# Altium schematic sheet LM2576_DC-DC_Converter.SchDoc
size A0
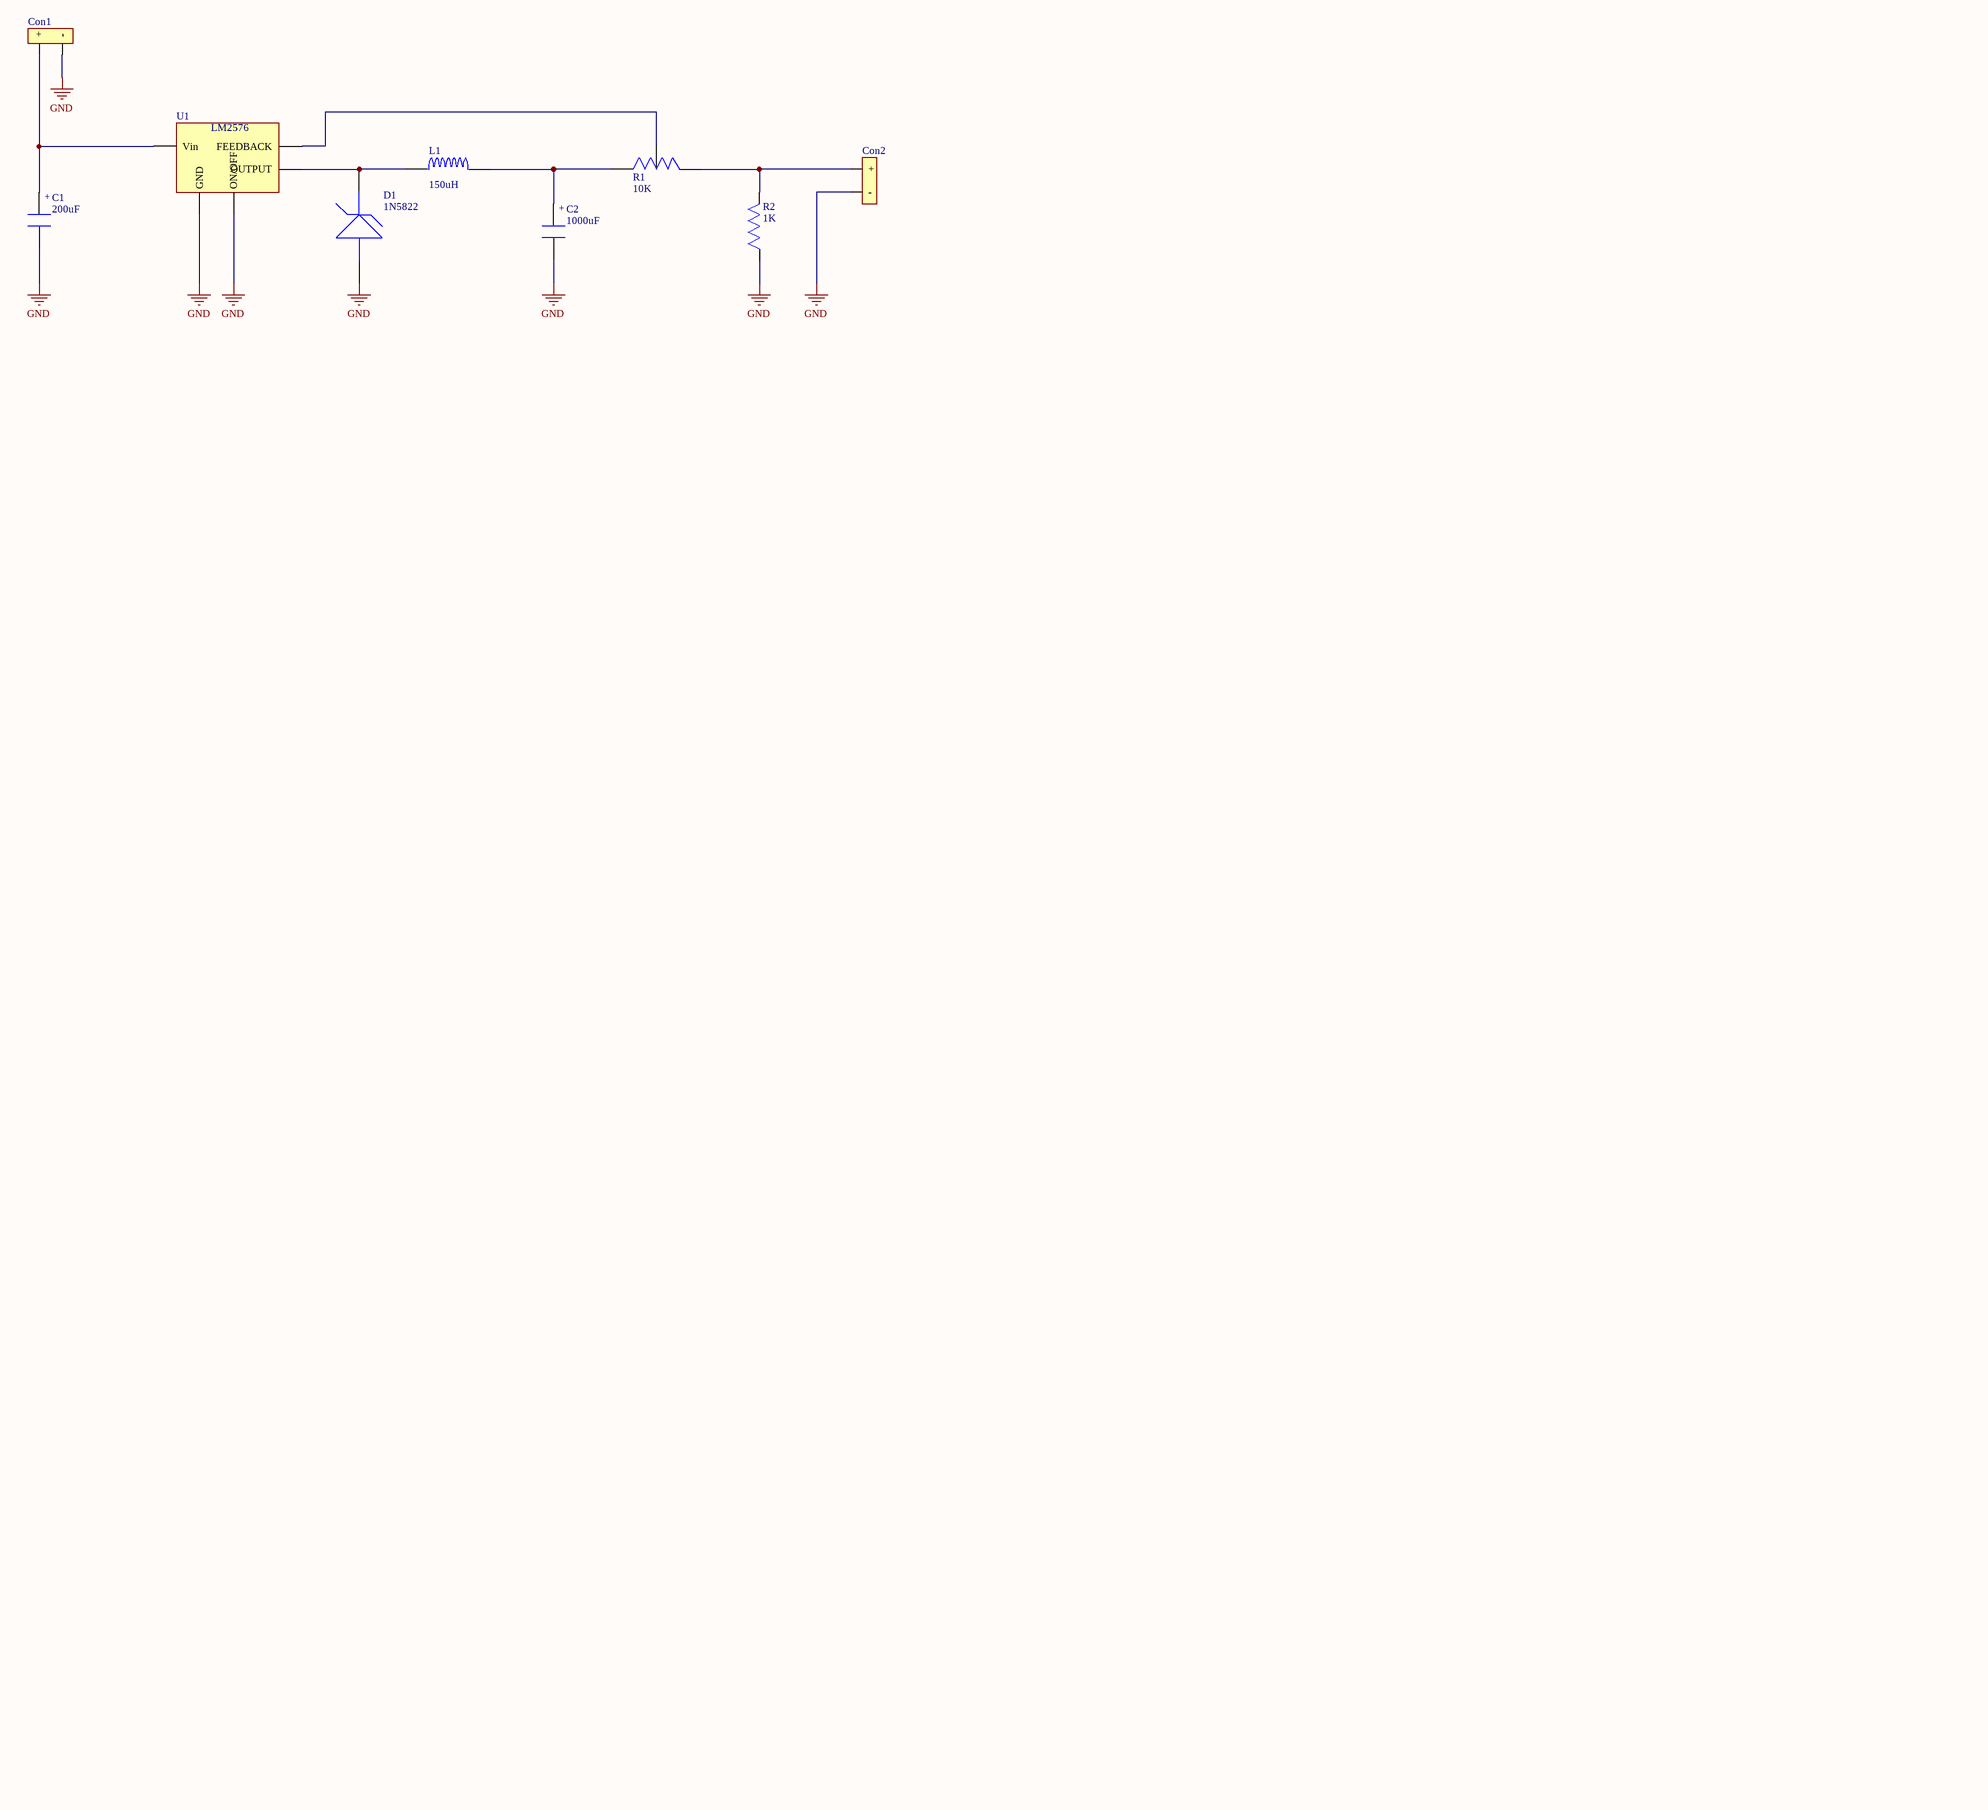
[diagram p0: LM2576_DC-DC_Converter.SchDoc]

## Parts
C1  200uF  [220uF Capacitor]
C2  1000uF  [1000Uf Cap]
Con1  2pinconnector  [2pin]  (value not drawn)
Con2  2pinconnector  [2pin]  (value not drawn)
D1  1N5822  [1n5822]
L1  150uH  [150uH Inductor]
R1  10K  [10K Pot]
R2  1K  [1K 1206 Res]
U1  LM2576  [LM2576-TO63-5]  (value not drawn)

## Nets
GND: C1.2 C2.2 Con1.2(-) Con2.2(-) D1.2 R2.1 U1.3(GND) U1.5(ON/OFF)
NetC1_1: C1.1 Con1.1(+) U1.1(Vin)
NetC2_1: C2.1 L1.2 R1.1
NetCon2_1: Con2.1(+) R1.3 R2.2
NetD1_1: D1.1 L1.1 U1.2(OUTPUT)
NetR1_2: R1.2 U1.4(FEEDBACK)

## Notes on the sheet
- (in symbol Electrolytic Cap 220uF) +
- (in symbol Electrolytic Cap_1000uF) +

## Library data of the parts
C1 = Electrolytic Cap 220uF: Cap Aluminum 220uF 50V 20% (10 X 10mm) SMD 220mA 1000 hr 105°C T/R; Manufacturer: Nichicon; Manufacturer Part Number: UWT1H221MNL1GS; Dielectric Material: Aluminium; Leakage Current: 3uA; Life (Hours): 1000Hour; Dissipation Factor: 0.14%; RoHS: Yes; Category: Aluminum Electrolytic Capacitors; Stock 1: 3000; Pricing 1: 1=0,68000, 10=0,47800, 50=0,36160, 100=0,31490 (USD); Mount: Surface Mount; Case/Package: SMD/SMT; Number of Pins: 2; Min Operating Temperature: -55°C; Max Operating Temperature: 105°C; Capacitance: 220uF; Tolerance: 20%; Ripple Current: 220mA; Termination: SMD/SMT; Voltage: 50V; Package Quantity: 500; Voltage Rating: 50V; Voltage Rating (DC): 50V; Packaging: Tape and Reel; Ripple Current (AC): 220mA; Diameter: 10mm; Length: 10mm; Height: 10mm; Height - Seated (Max): 0.394inch; Lead Pitch: 4.5mm; Radiation Hardening: No; REACH SVHC: No SVHC; Lead Free: Lead Free; ComponentLink1URL: https://datasheet.ciiva.com/11686/e-wt-11686311.pdf?src-supplier=Avnet; ComponentLink1Description: https://datasheet.ciiva.com/11686/e-wt-11686311.pdf?src-supplier=Avnet; ComponentLink2URL: https://datasheet.ciiva.com/97/e-wt-97496.pdf?src-supplier=Digi-Key; ComponentLink2Description: https://datasheet.ciiva.com/97/e-wt-97496.pdf?src-supplier=Digi-Key; ComponentLink3URL: https://datasheet.ciiva.com/97/e-wt-97498.pdf?src-supplier=Digi-Key; ComponentLink3Description: https://datasheet.ciiva.com/97/e-wt-97498.pdf?src-supplier=Digi-Key; ComponentLink4URL: https://datasheet.ciiva.com/16502/e-wt-16502942.pdf?src-supplier=Future+Electronics; ComponentLink4Description: https://datasheet.ciiva.com/16502/e-wt-16502942.pdf?src-supplier=Future+Electronics; ComponentLink5URL: https://datasheet.ciiva.com/7781/e-wt-7781462.pdf?src-supplier=Element14; ComponentLink5Description: https://datasheet.ciiva.com/7781/e-wt-7781462.pdf?src-supplier=Element14; ComponentLink6URL: https://datasheet.ciiva.com/97/e-wt-97497.pdf?src-supplier=Digi-Key; ComponentLink6Description: https://datasheet.ciiva.com/97/e-wt-97497.pdf?src-supplier=Digi-Key; ComponentLink7URL: https://datasheet.ciiva.com/28458/1910938-28458474.pdf?src-supplier=Element14; ComponentLink7Description: https://datasheet.ciiva.com/28458/1910938-28458474.pdf?src-supplier=Element14; ComponentLink8URL: https://datasheet.ciiva.com/17526/e-wt-17526124.pdf?src-supplier=Avnet+Europe; ComponentLink8Description: https://datasheet.ciiva.com/17526/e-wt-17526124.pdf?src-supplier=Avnet+Europe; Supplier 1: Digi-Key; Supplier Part Number 1: 493-2228-1-ND
C2 = Electrolytic Cap_1000uF: CAP ALUM 1000UF 20% 50V SMD; Manufacturer: Vishay BCcomponents; Manufacturer Part Number: MAL214699111E3; Capacitance: 1mF; Ripple Current: 1.5A; Impedance: 52mR; Life (Hours): 6000Hour; Leakage Current: 500uA; Polarity: Polar; Lead Diameter: 1.3mm; RoHS: Yes; Category: Aluminum Electrolytic Capacitors; Stock 1: 4157; Pricing 1: 1=3,56000, 10=3,44300, 50=3,08660 (USD); Mount: Surface Mount,PCB; Case/Package: Radial; Min Operating Temperature: -55°C; Max Operating Temperature: 125°C; Tolerance: 20%; Packaging: Tape and Reel; Package Quantity: 1; Voltage Rating: 50V; Voltage Rating (DC): 50V; Termination: SMD/SMT; Voltage: 50V; Diameter: 16mm; Height: 21mm; Width: 16mm; Lead Pitch: 6.5mm; Height - Seated (Max): 0.827inch; Radiation Hardening: No; ComponentLink1URL: https://datasheet.ciiva.com/100/146cti-100170.pdf?src-supplier=Digi-Key; ComponentLink1Description: https://datasheet.ciiva.com/100/146cti-100170.pdf?src-supplier=Digi-Key; ComponentLink2URL: https://datasheet.ciiva.com/100/146cti-100171.pdf?src-supplier=Digi-Key; ComponentLink2Description: https://datasheet.ciiva.com/100/146cti-100171.pdf?src-supplier=Digi-Key; ComponentLink3URL: https://datasheet.ciiva.com/100/146cti-100172.pdf?src-supplier=Digi-Key; ComponentLink3Description: https://datasheet.ciiva.com/100/146cti-100172.pdf?src-supplier=Digi-Key; ComponentLink4URL: https://datasheet.ciiva.com/11782/0900766b81003e87-11782463.pdf?src-supplier=RSComponents; ComponentLink4Description: https://datasheet.ciiva.com/11782/0900766b81003e87-11782463.pdf?src-supplier=RSComponents; ComponentLink5URL: https://datasheet.ciiva.com/11697/146cti-11697686.pdf?src-supplier=Avnet; ComponentLink5Description: https://datasheet.ciiva.com/11697/146cti-11697686.pdf?src-supplier=Avnet; ComponentLink6URL: https://datasheet.ciiva.com/5360/146cti-247382-5360174.pdf?src-supplier=Mouser; ComponentLink6Description: https://datasheet.ciiva.com/5360/146cti-247382-5360174.pdf?src-supplier=Mouser; Supplier 1: Digi-Key; Supplier Part Number 1: 4444PHCT-ND
Con1 Con2 = 2pinconnector: Conn Unshrouded Header HDR 2 POS 2.54mm Solder ST Thru-Hole KK® Bag; Manufacturer: Molex; Number of Positions: 2; Gender: Male; Voltage Rating (DC): 250V; Insulation Resistance: 50GR; Contact Resistance: 10mR; Current Rating: 4A; Glow Wire Compliant: Non-compliant; Manufacturer Part Number: 22-10-2021; RoHS: Yes; Category: Headers and Wire Housings; Stock 1: 6869; Pricing 1: 1=0,40000, 10=0,38300, 100=0,26800, 500=0,22974, 1000=0,19145, 5000=0,16410, 10000=0,15316 (USD); Mount: Through Hole; Housing Color: White; Housing Material: Nylon; Contact Plating: Gold; Contact Material: Brass; Min Operating Temperature: 0°C; Max Operating Temperature: 75°C; Termination: Solder; Number of Contacts: 2; Number of Circuits: 2; Orientation: Straight; Number of Rows: 1; Packaging: Bulk; Package Quantity: 3000; Voltage Rating: 250V; Pitch: 2.54mm; Radiation Hardening: No; REACH SVHC: Unknown; Halogen Free: Low Halogen; Lead Free: Lead Free; Flammability Rating: UL94 V-0; ComponentLink1URL: https://datasheet.ciiva.com/10088/0022102021-pcb-headers-10088323.pdf?src-supplier=Avnet; ComponentLink1Description: https://datasheet.ciiva.com/10088/0022102021-pcb-headers-10088323.pdf?src-supplier=Avnet; ComponentLink2URL: https://datasheet.ciiva.com/5159/0022102021-pcb-headers-158487-5159068.pdf?src-supplier=Mouser; ComponentLink2Description: https://datasheet.ciiva.com/5159/0022102021-pcb-headers-158487-5159068.pdf?src-supplier=Mouser; ComponentLink3URL: https://datasheet.ciiva.com/16727/0022102021-pcb-headers-16727093.pdf?src-supplier=Avnet+Europe; ComponentLink3Description: https://datasheet.ciiva.com/16727/0022102021-pcb-headers-16727093.pdf?src-supplier=Avnet+Europe; ComponentLink4URL: https://datasheet.ciiva.com/30179/126490022102021-pcb-headers-30179367.pdf?src-supplier=Onlinecomponents.com; ComponentLink4Description: https://datasheet.ciiva.com/30179/126490022102021-pcb-headers-30179367.pdf?src-supplier=Onlinecomponents.com; ComponentLink5URL: https://datasheet.ciiva.com/49385/878868-49385685.pdf?src-supplier=Jameco; ComponentLink5Description: https://datasheet.ciiva.com/49385/878868-49385685.pdf?src-supplier=Jameco; ComponentLink6URL: https://datasheet.ciiva.com/1433/1862685-1433864.pdf?src-supplier=Element14; ComponentLink6Description: https://datasheet.ciiva.com/1433/1862685-1433864.pdf?src-supplier=Element14; ComponentLink7URL: https://datasheet.ciiva.com/15217/getdatasheetpartid-251334-15217596.pdf?src-supplier=Verical; ComponentLink7Description: https://datasheet.ciiva.com/15217/getdatasheetpartid-251334-15217596.pdf?src-supplier=Verical; Supplier 1: Digi-Key; Supplier Part Number 1: WM2722-ND
D1 = 1N5822: DIODE SCHOTTKY 40V 3A DO214AC; Manufacturer: MCC; Manufacturer Part Number: SK34A-LTP; Element Configuration: Single; Peak Non-Repetitive Surge Current: 80A; Forward Voltage: 500mV; RoHS: Yes; Category: Rectifier Diodes; Stock 1: 124742; Pricing 1: 1=0,47000, 10=0,31900, 100=0,18850, 500=0,12760, 1000=0,09570 (USD); Mount: Surface Mount; Case/Package: SMA; Number of Pins: 2; Weight: 0.003739oz; Min Operating Temperature: -50°C; Max Operating Temperature: 125°C; Max Reverse Voltage (DC): 40V; Average Rectified Current: 3A; Package Quantity: 1; Forward Current: 3A; Max Repetitive Reverse Voltage (Vrrm): 40V; Packaging: Tape and Reel; Max Forward Surge Current (Ifsm): 80A; Radiation Hardening: No; ComponentLink1URL: https://datasheet.ciiva.com/15200/getdatasheetpartid-723745-15200572.pdf?src-supplier=Verical; ComponentLink1Description: https://datasheet.ciiva.com/15200/getdatasheetpartid-723745-15200572.pdf?src-supplier=Verical; ComponentLink2URL: https://datasheet.ciiva.com/917/sk32a-ltsk310a-lt28do-214ac29-917378.pdf?src-supplier=Digi-Key; ComponentLink2Description: https://datasheet.ciiva.com/917/sk32a-ltsk310a-lt28do-214ac29-917378.pdf?src-supplier=Digi-Key; ComponentLink3URL: https://datasheet.ciiva.com/917/sk32a-ltsk310a-lt28do-214ac29-917379.pdf?src-supplier=Digi-Key; ComponentLink3Description: https://datasheet.ciiva.com/917/sk32a-ltsk310a-lt28do-214ac29-917379.pdf?src-supplier=Digi-Key; ComponentLink4URL: https://datasheet.ciiva.com/917/sk32a-ltsk310a-lt28do-214ac29-917380.pdf?src-supplier=Digi-Key; ComponentLink4Description: https://datasheet.ciiva.com/917/sk32a-ltsk310a-lt28do-214ac29-917380.pdf?src-supplier=Digi-Key; Supplier 1: Digi-Key; Supplier Part Number 1: SK34A-LTPMSCT-ND
L1 = 150uH L: Manufacturer: Wurth Electronics; Manufacturer Part Number: 7447706151; RoHS: No; Stock 1: 1000; Pricing 1: 1=1,75000, 10=1,63000, 50=1,49000, 100=1,36000 (USD); Supplier 1: Digi-Key
R1 = Variable Resistor: POT, TRIMMER, 10KOHM, 25TURN, PANEL; Product Range:AEC-Q200 3296W Series; Track Resistance:10kohm; No. of Turns:25Turns; Power Rating:500mW; Resistance Tolerance: 10%; Temperature Coefficient: 100ppm/ C ;RoHS Compliant: Yes; Manufacturer: Bourns; Manufacturer Part Number: 3296W-1-103RLF; Resistance: 10kR; Temperature Coefficient: 100ppm/°C; Max Power Dissipation: 500mW; Number of Turns: 25; RoHS: Yes; Category: Variable Resistors and Potentiometers; Stock 1: 3943; Pricing 1: 1=3,97000, 10=3,47300, 25=3,10040, 50=2,91440, 100=2,85250, 250=2,72844, 500=2,23236 (USD); Mount: Through Hole,PCB; Weight: 0.03oz; Contact Plating: Tin,Matte; Min Operating Temperature: -55°C; Max Operating Temperature: 125°C; Tolerance: 10%; Taper: Linear; Military Standard: Not; Package Quantity: 1; Power Rating: 500mW; Composition: Cermet; Packaging: Tape and Reel; Termination: Pin; Length: 9.53mm; Height: 0.395inch; Depth: 4.83mm; Width: 0.19inch; Radiation Hardening: No; REACH SVHC: No SVHC; ComponentLink1URL: https://datasheet.ciiva.com/16807/3296-16807592.pdf?src-supplier=Avnet+Europe; ComponentLink1Description: https://datasheet.ciiva.com/16807/3296-16807592.pdf?src-supplier=Avnet+Europe; ComponentLink2URL: https://datasheet.ciiva.com/8088/3296-8088775.pdf?src-supplier=Avnet; ComponentLink2Description: https://datasheet.ciiva.com/8088/3296-8088775.pdf?src-supplier=Avnet; ComponentLink3URL: https://datasheet.ciiva.com/15156/getdatasheetpartid-227249-15156874.pdf?src-supplier=Verical; ComponentLink3Description: https://datasheet.ciiva.com/15156/getdatasheetpartid-227249-15156874.pdf?src-supplier=Verical; ComponentLink4URL: https://datasheet.ciiva.com/6226/3296-6226765.pdf?src-supplier=Digi-Key; ComponentLink4Description: https://datasheet.ciiva.com/6226/3296-6226765.pdf?src-supplier=Digi-Key; ComponentLink5URL: https://datasheet.ciiva.com/6226/3296-6226767.pdf?src-supplier=Digi-Key; ComponentLink5Description: https://datasheet.ciiva.com/6226/3296-6226767.pdf?src-supplier=Digi-Key; Supplier 1: Digi-Key; Supplier Part Number 1: 3296W-1-103RLFCT-ND
R2 = Resistor: RES SMD 1K OHM 5% 1/4W 1206; Manufacturer: Yageo; Manufacturer Part Number: RC1206JR-071KL; Max Power Dissipation: 250mW; Temperature Coefficient: 100ppm/°C; Resistance: 1kR; Voltage Rating: 200V; RoHS: Yes; Category: Chip SMD Resistors; Stock 1: 1963755; Pricing 1: 1=0,10000, 10=0,05900, 100=0,02400, 1000=0,01079, 2500=0,00936 (USD); Case/Package: 1206; Case Code (Metric): 3216; Case Code (Imperial): 1206; Min Operating Temperature: -55°C; Max Operating Temperature: 155°C; Composition: Thick Film; Number of Terminations: 2; Termination: SMD/SMT; Military Standard: Not; Package Quantity: 1; Power Rating: 250mW; Tolerance: 5%; Packaging: Tape and Reel; Length: 3.1mm; Height: 0.026inch; Depth: 1.6mm; Width: 0.063inch; Lead Free: Lead Free; REACH SVHC: Unknown; ComponentLink1URL: https://datasheet.ciiva.com/2458/pyu-r-int-thick-7-2458673.pdf?src-supplier=Digi-Key; ComponentLink1Description: https://datasheet.ciiva.com/2458/pyu-r-int-thick-7-2458673.pdf?src-supplier=Digi-Key; ComponentLink2URL: https://datasheet.ciiva.com/2458/pyu-r-int-thick-7-2458672.pdf?src-supplier=Digi-Key; ComponentLink2Description: https://datasheet.ciiva.com/2458/pyu-r-int-thick-7-2458672.pdf?src-supplier=Digi-Key; ComponentLink3URL: https://datasheet.ciiva.com/2458/pyu-r-int-thick-7-2458671.pdf?src-supplier=Digi-Key; ComponentLink3Description: https://datasheet.ciiva.com/2458/pyu-r-int-thick-7-2458671.pdf?src-supplier=Digi-Key; Supplier 1: Digi-Key; Supplier Part Number 1: 311-1.0KERCT-ND
U1 = LM2576: Conv DC-DC Single Inv/Step Down 4V to 60V 6-Pin(5+Tab) TO-263 T/R; Manufacturer: TI National Semiconductor; Manufacturer Part Number: LM2576HVSX-ADJ/NOPB; Number of Outputs: 1; Output Voltage: 57V; Max Output Current: 3A; Switching Frequency: 58kHz; Efficiency: 77%; Synchronous Rectifier: No; Quiescent Current: 5mA; Output Type: Adjustable; Min Output Voltage: 1.23V; RoHS: Yes; Category: Voltage Regulators - Switching; Stock 1: 2345; Pricing 1: 1=6,10000, 10=5,47400, 25=5,17520, 100=4,25500, 250=3,81800 (USD); Mount: Surface Mount; Case/Package: TO-263-5; Number of Pins: 5; Contact Plating: Tin; Min Operating Temperature: -40°C; Max Operating Temperature: 125°C; Min Input Voltage: 4V; Max Input Voltage: 60V; Operating Supply Voltage: 60V; Packaging: Tape and Reel; Output Current: 3A; Package Quantity: 500; Max Output Voltage: 57V; Radiation Hardening: No; Lead Free: Contains Lead; REACH SVHC: No SVHC; ComponentLink1URL: https://datasheet.ciiva.com/34303/1992566-34303691.pdf?src-supplier=Jameco; ComponentLink1Description: https://datasheet.ciiva.com/34303/1992566-34303691.pdf?src-supplier=Jameco; ComponentLink2URL: https://datasheet.ciiva.com/41457/001013734-da-01-en-ic-reg-lm2576hvsx-adj-nopb-to-263-5-tid-41457610.pdf?src-supplier=Conrad; ComponentLink2Description: https://datasheet.ciiva.com/41457/001013734-da-01-en-ic-reg-lm2576hvsx-adj-nopb-to-263-5-tid-41457610.pdf?src-supplier=Conrad; ComponentLink3URL: https://datasheet.ciiva.com/6596/lm2576hv-6596698.pdf?src-supplier=Digi-Key; ComponentLink3Description: https://datasheet.ciiva.com/6596/lm2576hv-6596698.pdf?src-supplier=Digi-Key; ComponentLink4URL: https://datasheet.ciiva.com/6596/lm2576hv-6596700.pdf?src-supplier=Digi-Key; ComponentLink4Description: https://datasheet.ciiva.com/6596/lm2576hv-6596700.pdf?src-supplier=Digi-Key; ComponentLink5URL: https://datasheet.ciiva.com/6596/lm2576hv-6596701.pdf?src-supplier=Digi-Key; ComponentLink5Description: https://datasheet.ciiva.com/6596/lm2576hv-6596701.pdf?src-supplier=Digi-Key; Supplier 1: Digi-Key; Supplier Part Number 1: LM2576HVSX-ADJ/NOPBCT-ND